# EAGLE design PUENTE H (EAGLE 8.6.0)
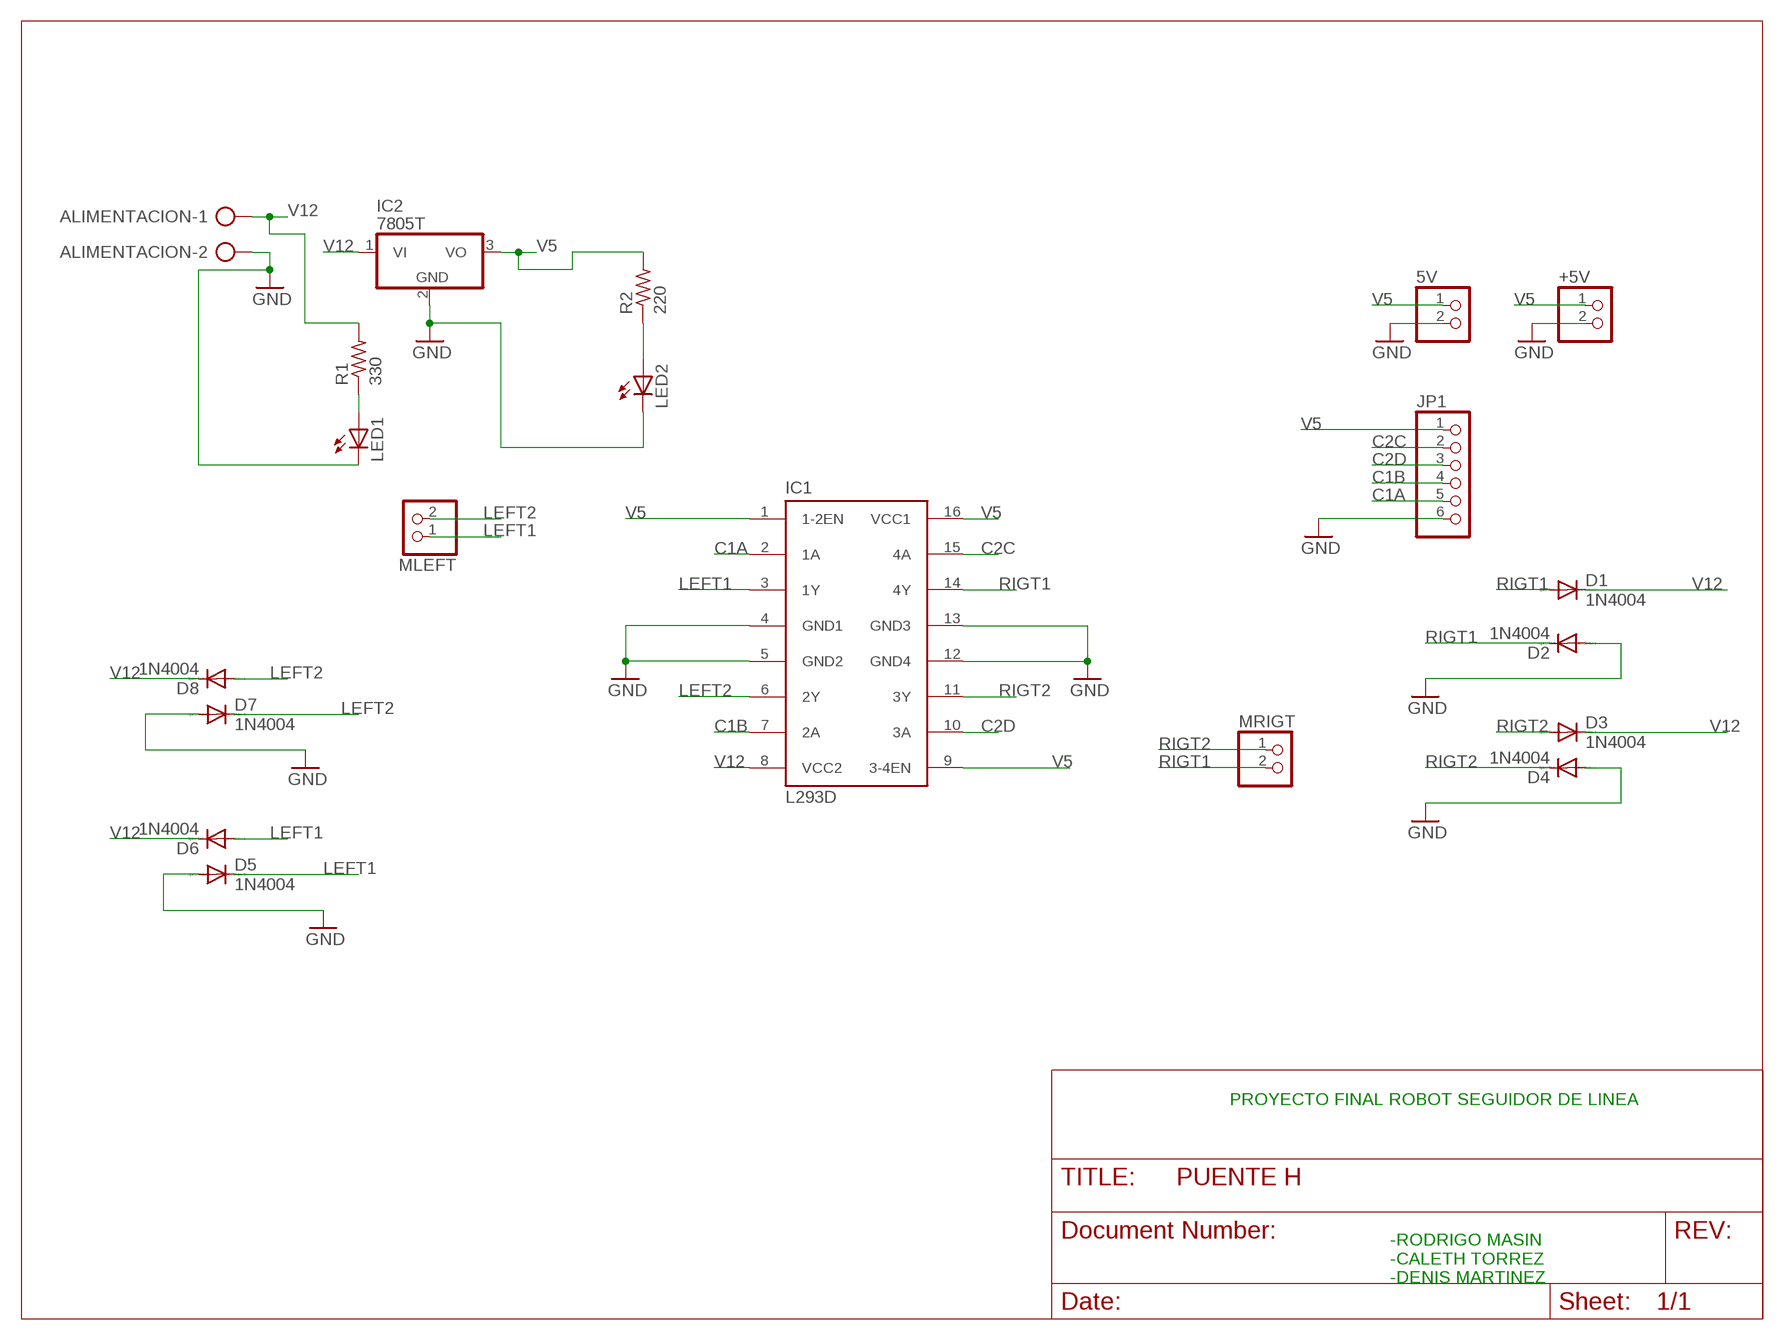
[diagram p0: schematic, sheet 1]

## Parts
5V  PINHD-1X2  [1X02]
+5V  PINHD-1X2  [1X02]
ALIMENTACION  AK500/2-H  [AK500/2-H]
D1  1N4004  [DO41-10]
D2  1N4004  [DO41-10]
D3  1N4004  [DO41-10]
D4  1N4004  [DO41-10]
D5  1N4004  [DO41-10]
D6  1N4004  [DO41-10]
D7  1N4004  [DO41-10]
D8  1N4004  [DO41-10]
IC1  L293D  [DIL16]
IC2  7805T  [TO220H]
JP1  PINHD-1X6  [1X06]
LED1  LED5MM  [LED5MM]
LED2  LED5MM  [LED5MM]
MLEFT  PINHD-1X2  [1X02]
MRIGT  PINHD-1X2  [1X02]
R1  330  R-US_0204/7  [0204/7]
R2  220  R-US_0204/7  [0204/7]

## Nets
C1A: IC1.2(1A) JP1.5
C1B: IC1.7(2A) JP1.4
C2C: IC1.15(4A) JP1.2
C2D: IC1.10(3A) JP1.3
GND: 5V.2 +5V.2 ALIMENTACION.2 D2.A D4.A D5.A D7.A IC1.4(GND1) IC1.5(GND2) IC1.12(GND4) IC1.13(GND3) IC2.2(GND) JP1.6 LED1.K(C) LED2.K(C)
LEFT1: D5.C D6.A IC1.3(1Y) MLEFT.1
LEFT2: D7.C D8.A IC1.6(2Y) MLEFT.2
N$2: LED1.A R1.1
N$5: LED2.A R2.1
RIGT1: D1.A D2.C IC1.14(4Y) MRIGT.2
RIGT2: D3.A D4.C IC1.11(3Y) MRIGT.1
V5: 5V.1 +5V.1 IC1.1(1-2EN) IC1.9(3-4EN) IC1.16(VCC1) IC2.3(VO) JP1.1 R2.2
V12: ALIMENTACION.1 D1.C D3.C D6.C D8.C IC1.8(VCC2) IC2.1(VI) R1.2

## Notes on the sheet
- PROYECTO FINAL ROBOT SEGUIDOR DE LINEA
- -RODRIGO MASIN
  -CALETH TORREZ
  -DENIS MARTINEZ

## Library data of the parts
5V +5V MLEFT MRIGT = pinhead:PINHD-1X2: PIN HEADER
ALIMENTACION = con-ptr500:AK500/2-H: CONNECTOR Aug. 2004 / PTR Meßtechnik: Die Bezeichnung der Serie AK505 wurde geändert. Es handelt sich hierbei um AK500 in horizontaler Ausführung.; OC_FARNELL: unknown; OC_NEWARK: unknown
D1-D8 = diode:1N4004: DIODE general purpose rectifier, 1 A
IC1 = st-microelectronics:L293D: PUSH-PULL 4 CHANNEL DRIVER; MPN: L293D; OC_FARNELL: 9589619; OC_NEWARK: 56P8249
IC2 = linear:78*: Positive VOLTAGE REGULATOR Source: http://cache.national.com/ds/LM/LM78L05.pdf http://www.fairchildsemi.com/ds/LM/LM7805.pdf
JP1 = pinhead:PINHD-1X6: PIN HEADER
LED1 LED2 = led:LED: LED OSRAM: - CHIPLED LG R971, LG N971, LY N971, LG Q971, LY Q971, LO R971, LY R971 LH N974, LH R974 LS Q976, LO Q976, LY Q976 LO Q996 - Hyper CHIPLED LW Q18S LB Q993, LB Q99A, LB R99A - SideLED LS A670, LO A670, LY A670, LG A670, LP A670 LB A673, LV A673, LT A673, LW A673 LH A674 LY A675 LS A676, LA A676, LO A676, LY A676, LW A676 LS A679, LY A679, LG A679 - Hyper Micro SIDELED® LS Y876, LA Y876, LO Y876, LY Y876 LT Y87S - SmartLED LW L88C, LW L88S LB L89C, LB L89S, LG L890 LS L89K, LO L89K, LY L89K LS L896, LA L896, LO L896, LY L896 - TOPLED LS T670, LO T670, LY T670, LG T670, LP T670 LSG T670, LSP T670, LSY T670, LOP T670, LYG T670 LG T671, LOG T671, LSG T671 LB T673, LV T673, LT T673, LW T673 LH T674 LS T676, LA T676, LO T676, LY T676, LB T676, LH T676, LSB T676, LW T676 LB T67C, LV T67C, LT T67C, LS T67K, LO T67K, LY T67K, LW E67C LS E67B, LA E67B, LO E67B, LY E67B, LB E67C, LV E67C, LT E67C LW T67C LS T679, LY T679, LG T679 LS T770, LO T770, LY T770, LG T770, LP T770 LB T773, LV T773, LT T773, LW T773 LH T774 LS E675, LA E675, LY E675, LS T675 LS T776, LA T776, LO T776, LY T776, LB T776 LHGB T686 LT T68C, LB T68C - Hyper Mini TOPLED® LB M676 - Mini TOPLED Santana® LG M470 LS M47K, LO M47K, LY M47K Source: http://www.osram.convergy.de LUXEON: - LUMILED® LXK2-PW12-R00, LXK2-PW12-S00, LXK2-PW14-U00, LXK2-PW14-V00 LXK2-PM12-R00, LXK2-PM12-S00, LXK2-PM14-U00 LXK2-PE12-Q00, LXK2-PE12-R00, LXK2-PE12-S00, LXK2-PE14-T00, LXK2-PE14-U00 LXK2-PB12-K00, LXK2-PB12-L00, LXK2-PB12-M00, LXK2-PB14-N00, LXK2-PB14-P00, LXK2-PB14-Q00 LXK2-PR12-L00, LXK2-PR12-M00, LXK2-PR14-Q00, LXK2-PR14-R00 LXK2-PD12-Q00, LXK2-PD12-R00, LXK2-PD12-S00 LXK2-PH12-R00, LXK2-PH12-S00 LXK2-PL12-P00, LXK2-PL12-Q00, LXK2-PL12-R00 Source: www.luxeon.com KINGBRIGHT: KA-3528ASYC Source: www.kingbright.com
R1 R2 = resistor:R-US_: RESISTOR, American symbol

## Board
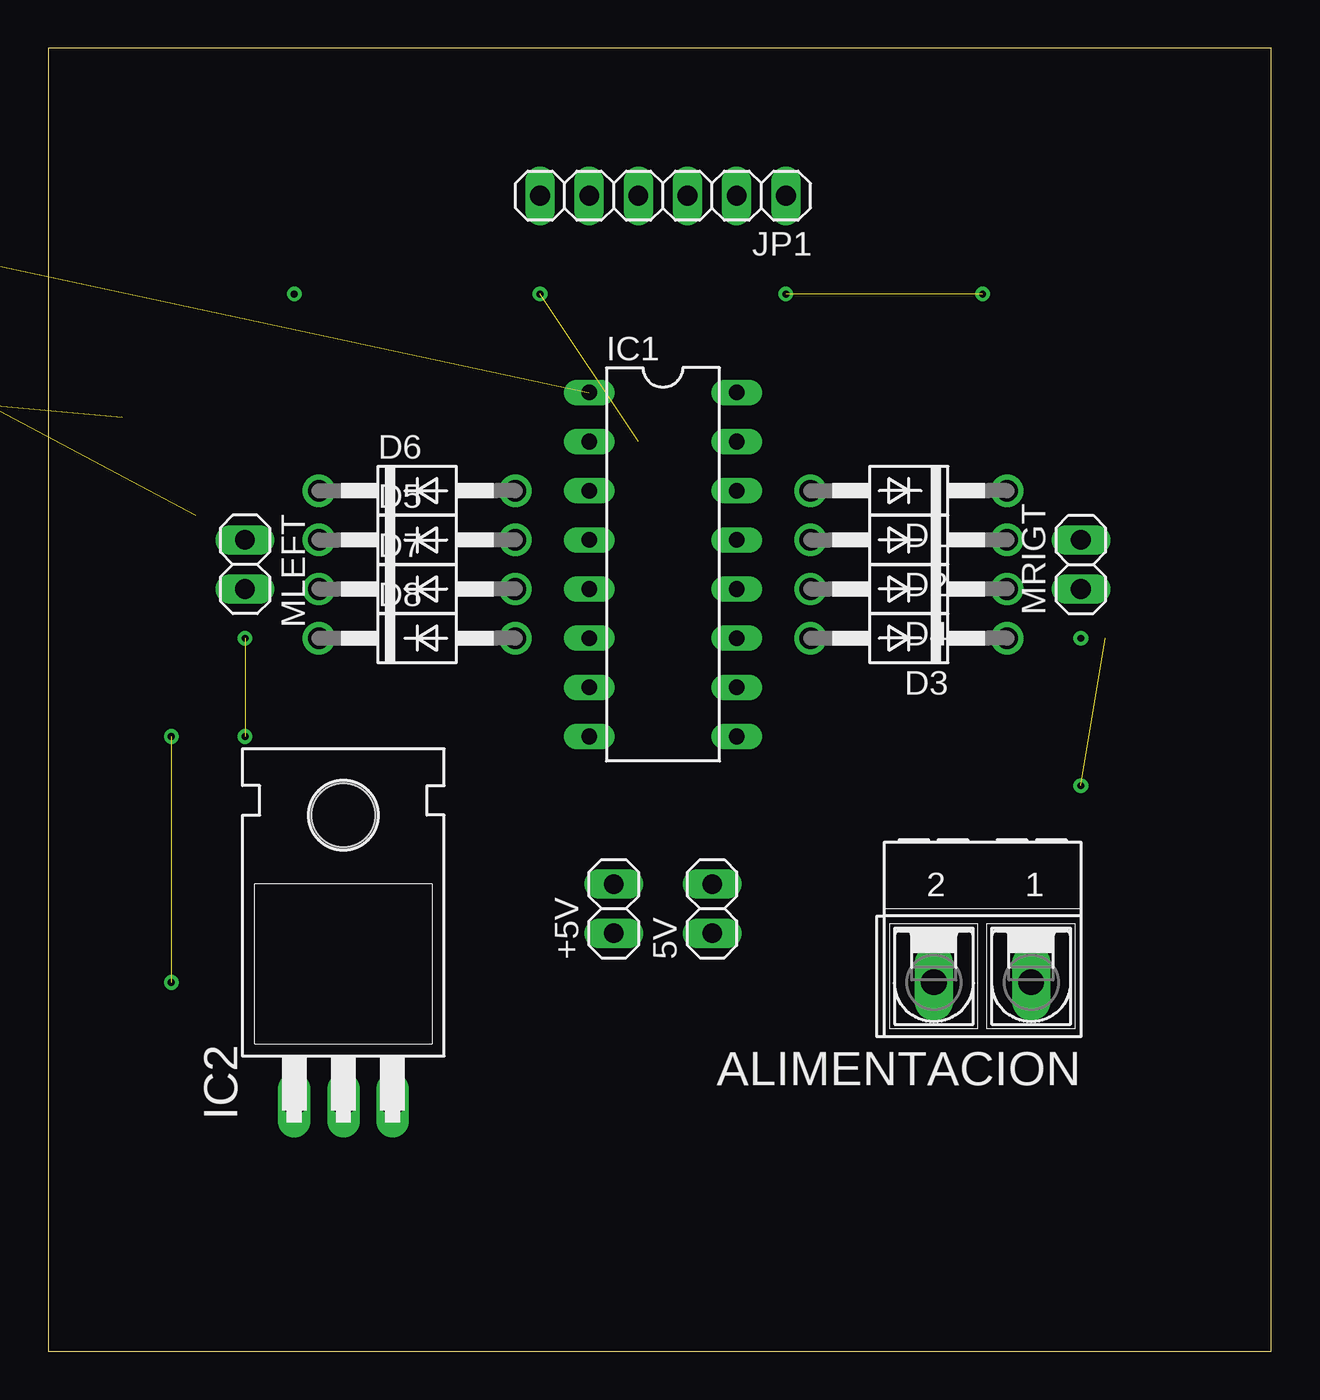
[diagram p1: board, top side]
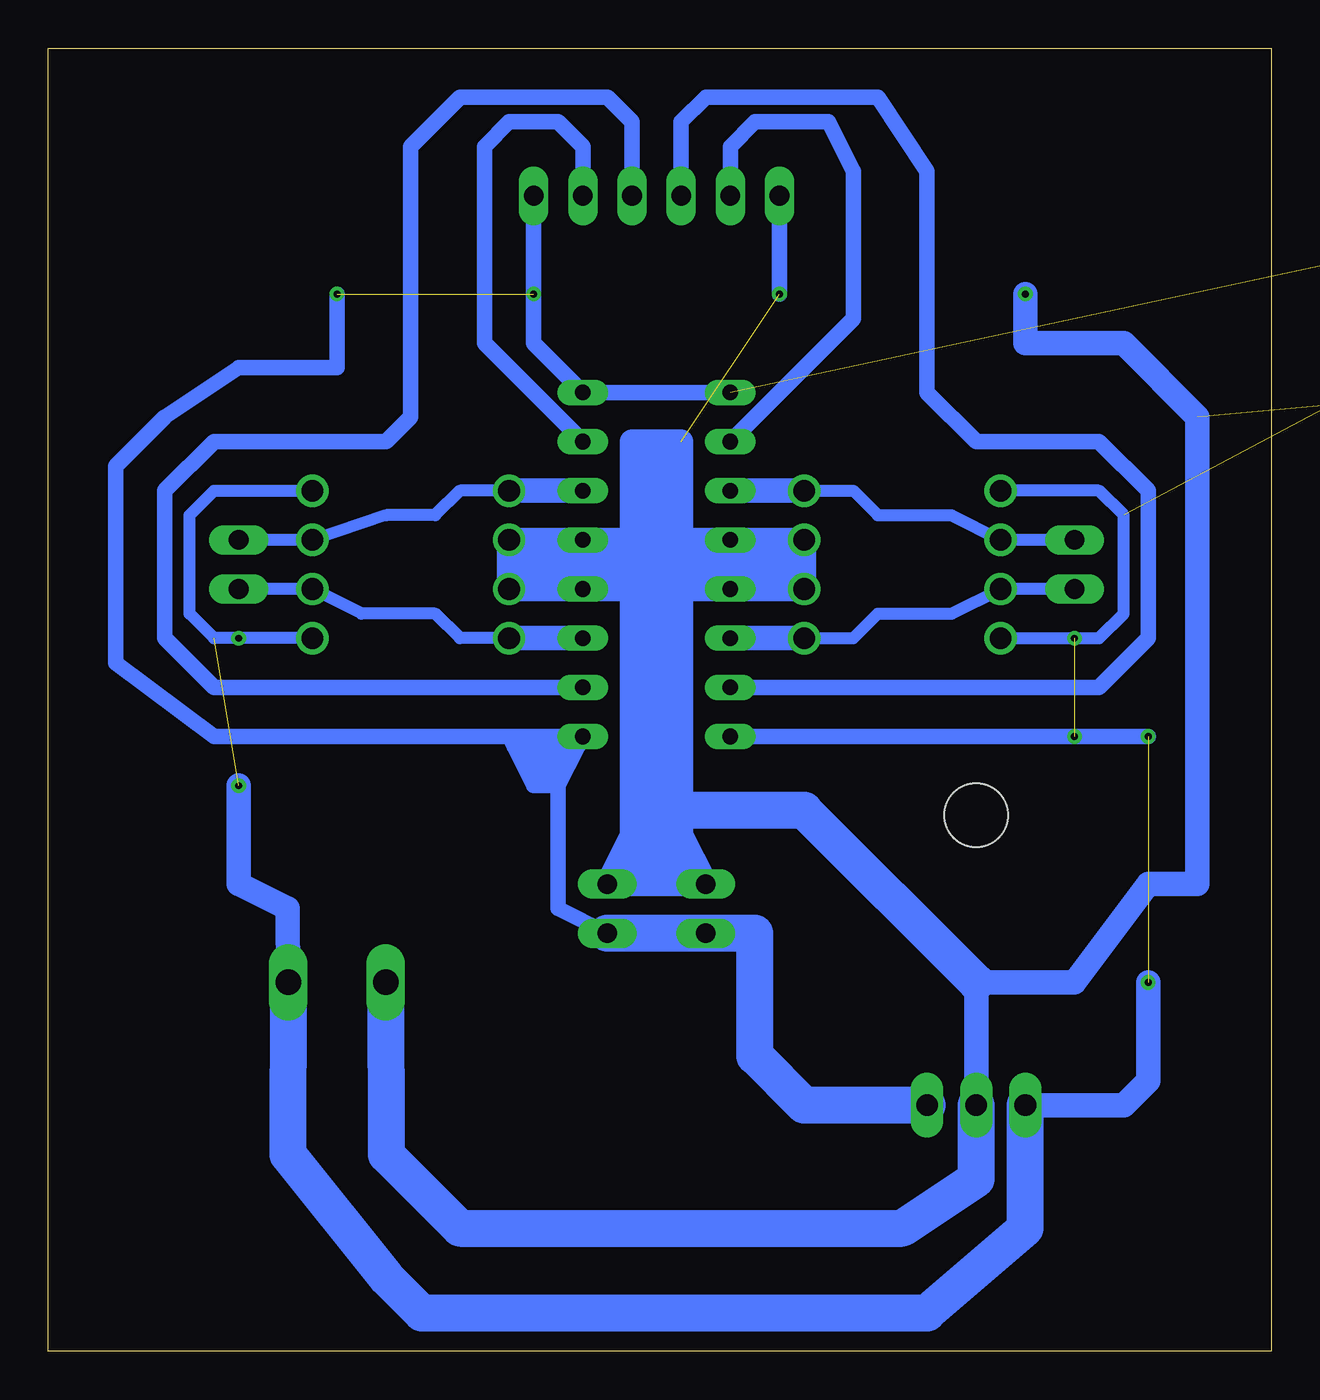
[diagram p2: board, bottom side, seen from below]

Size 63.17 x 67.3 mm. Coordinates in mm from the lower left corner, seen from the top.
Outline: 0,0 63.17,0 63.17,67.3 0,67.3 0,0
Copper layers (1*16): Top 0.035mm / dielectric 1.5mm / Bottom 0.035mm
Design rules "default": minimum track width 6mil, minimum drill 0.35mm, track to track 6mil, track to pad 6mil, pad to pad 6mil, via to via 6mil, smd to smd 6mil, copper to edge 40mil, drill to drill 6mil, minimum pad ring 10mil, minimum via ring 8mil, stop-mask expansion 4mil, vias tented up to drill 0mil, thermal gap 10mil

### Footprints (pad centres in the part's own frame; a part is rotated, then mirrored left to right if it is on the bottom)
1X02 = drill 1.016 long: 1 -1.27,0; 2 1.27,0
AK500/2-H = drill 1.321 long: 1 -2.515,0; 2 2.515,0
DO41-10 = drill 1.118: A 5.08,0; C -5.08,0
DIL16 = drill 0.813 long: 1 -8.89,-3.81; 2 -6.35,-3.81; 3 -3.81,-3.81; 4 -1.27,-3.81; 5 1.27,-3.81; 6 3.81,-3.81; 7 6.35,-3.81; 8 8.89,-3.81; 9 8.89,3.81; 10 6.35,3.81; 11 3.81,3.81; 12 1.27,3.81; 13 -1.27,3.81; 14 -3.81,3.81; 15 -6.35,3.81; 16 -8.89,3.81
TO220H = drill 1.118 long: 1 -2.54,-10.16; 2 0,-10.16; 3 2.54,-10.16 | hole 3.302: 0,4.826
1X06 = drill 1.016 long: 1 -6.35,0; 2 -3.81,0; 3 -1.27,0; 4 1.27,0; 5 3.81,0; 6 6.35,0
LED5MM = drill 0.813 octagon: A -1.27,0; K 1.27,0
0204/7 = drill 0.813 octagon: 1 -3.81,0; 2 3.81,0

### Placement (x,y rotation side)
5V  34.29,22.86 90 top
+5V  29.21,22.86 90 top
ALIMENTACION  48.26,19.05 180 top
D1  44.45,44.45 180 top
D2  44.45,41.91 180 top
D3  44.45,36.83 180 top
D4  44.45,39.37 180 top
D5  19.05,41.91 0 top
D6  19.05,44.45 0 top
D7  19.05,39.37 0 top
D8  19.05,36.83 0 top
IC1  31.75,40.64 270 top
IC2  15.24,22.86 0 top
JP1  31.75,59.69 180 top
LED1  -53.34,53.34 0 top  (outside the outline)
LED2  -66.04,53.34 0 top  (outside the outline)
MLEFT  10.16,40.64 270 top
MRIGT  53.34,40.64 90 top
R1  -36.83,64.77 0 top  (outside the outline)
R2  -46.99,64.77 0 top  (outside the outline)

### Tracks (layer width: path | path; a pad name or v marks a point on that pad's centre or on a via)
C1A
  Bottom 0.813: IC1.2 21.59,53.34 21.59,60.96 22.86,63.5 26.67,63.5 27.94,62.23 JP1.5
C1B
  Bottom 0.813: IC1.7 8.89,34.29 6.35,36.83 6.35,44.45 8.89,46.99 15.24,46.99 17.78,49.53 17.78,60.96 20.32,64.77 29.21,64.77 30.48,63.5 JP1.4
C2C
  Bottom 0.813: IC1.15 40.64,52.07 40.64,62.23 39.37,63.5 36.83,63.5 35.56,62.23 JP1.2
C2D
  Bottom 0.813: IC1.10 54.61,34.29 57.15,36.83 57.15,44.45 54.61,46.99 45.72,46.99 44.45,48.26 44.45,62.23 41.91,64.77 34.29,64.77 33.02,63.5 JP1.3
GND  (via drill 0.35)  (3 unrouted)
  Bottom 0.813: JP1.6 v25.4,54.61
  Bottom 1.27: 24.13,40.64 D7.A IC1.5 | 24.13,40.64 D5.A IC1.4 | IC1.4 30.48,41.91 | 33.02,41.91 IC1.13 | IC1.13 IC1.12 | IC1.12 33.02,39.37 | 33.02,39.37 31.75,39.37 | 31.75,39.37 30.48,39.37 | 30.48,39.37 IC1.5 | IC1.5 IC1.4 | IC1.12 D4.A 39.37,40.64 | 39.37,40.64 D2.A IC1.13 | 24.13,40.64 31.75,40.64 | 31.75,40.64 39.37,40.64 | 30.48,41.91 30.48,46.99 31.75,46.99 | 31.75,46.99 33.02,46.99 33.02,41.91 | 31.75,40.64 31.75,46.99 | 30.48,41.91 33.02,41.91 | 5V.2 +5V.2 30.48,26.67 30.48,27.94 30.48,39.37 | 5V.2 33.02,26.67 | 33.02,26.67 33.02,39.37 | 31.75,39.37 31.75,26.67 | 31.75,26.67 30.48,25.4 33.02,25.4 33.02,26.67 | 5V.2 31.75,26.67 | IC2.2 15.24,19.05 10.16,19.05 6.35,24.13 3.81,24.13 3.81,48.26 7.62,52.07 12.7,52.07 v12.7,54.61
  Bottom 1.905: ALIMENTACION.2 45.72,10.16 41.91,6.35 19.05,6.35 15.24,8.89 IC2.2 | 30.48,27.94 24.13,27.94 15.24,19.05
LEFT1
  Bottom 0.61: D6.A 21.59,44.45 20.32,43.18 16.51,43.18 D5.C MLEFT.1
  Bottom 1.27: D6.A IC1.3
LEFT2
  Bottom 0.61: D8.A 21.59,36.83 20.32,38.1 16.51,38.1 D7.C MLEFT.2
  Bottom 1.27: D8.A IC1.6
N$2  (1 unrouted)
N$5  (1 unrouted)
RIGT1
  Bottom 0.61: D1.A 41.91,44.45 43.18,43.18 45.72,43.18 D2.C MRIGT.2
  Bottom 1.27: IC1.14 D1.A
RIGT2
  Bottom 0.61: D3.A 41.91,36.83 43.18,38.1 46.99,38.1 D4.C MRIGT.1
  Bottom 1.27: IC1.11 D3.A
V5  (via drill 0.35)  (2 unrouted)
  Bottom 0.813: IC1.1 IC1.16 38.1,52.07 v38.1,54.61 JP1.1 | 5V.1 36.83,22.86 36.83,29.21 | 36.83,29.21 35.81,31.24 | 35.81,31.24 IC1.9 36.83,31.75 | 36.83,31.75 38.1,31.75 | 38.1,31.75 39.37,31.75 | 39.37,31.75 54.61,31.75 59.69,35.56 59.69,45.72 57.15,48.26 53.34,50.8 48.26,50.8 v48.26,54.61 | 36.83,29.21 38.1,29.21 | 38.1,29.21 39.12,31.24 | 39.12,31.24 39.37,31.75 | 38.1,29.21 37.34,30.73 | 37.34,30.73 36.83,31.75 | 36.83,29.21 36.83,31.75 | 36.83,29.21 38.1,31.75 | 38.1,30.48 38.71,30.94 | 38.71,30.94 39.12,31.24 | 38.1,31.75 38.71,30.94 | 37.34,30.73 35.81,31.24
  Bottom 1.905: IC2.3 24.13,12.7 26.67,15.24 26.67,21.59 +5V.1 5V.1
V12  (via drill 0.35)  (4 unrouted)
  Bottom 0.61: D3.C v53.34,36.83 54.61,36.83 55.88,38.1 55.88,43.18 54.61,44.45 D1.C | D8.C v10.16,36.83 8.89,36.83 7.62,38.1 7.62,43.18 8.89,44.45 D6.C
  Bottom 0.813: IC1.8 v10.16,31.75 v6.35,31.75
  Bottom 1.27: IC2.1 7.62,12.7 6.35,13.97 v6.35,19.05 | ALIMENTACION.1 50.8,22.86 53.34,24.13 v53.34,29.21
  Bottom 1.905: ALIMENTACION.1 50.8,10.16 45.72,3.81 43.88,1.97 17.78,1.97 12.7,6.35 IC2.1